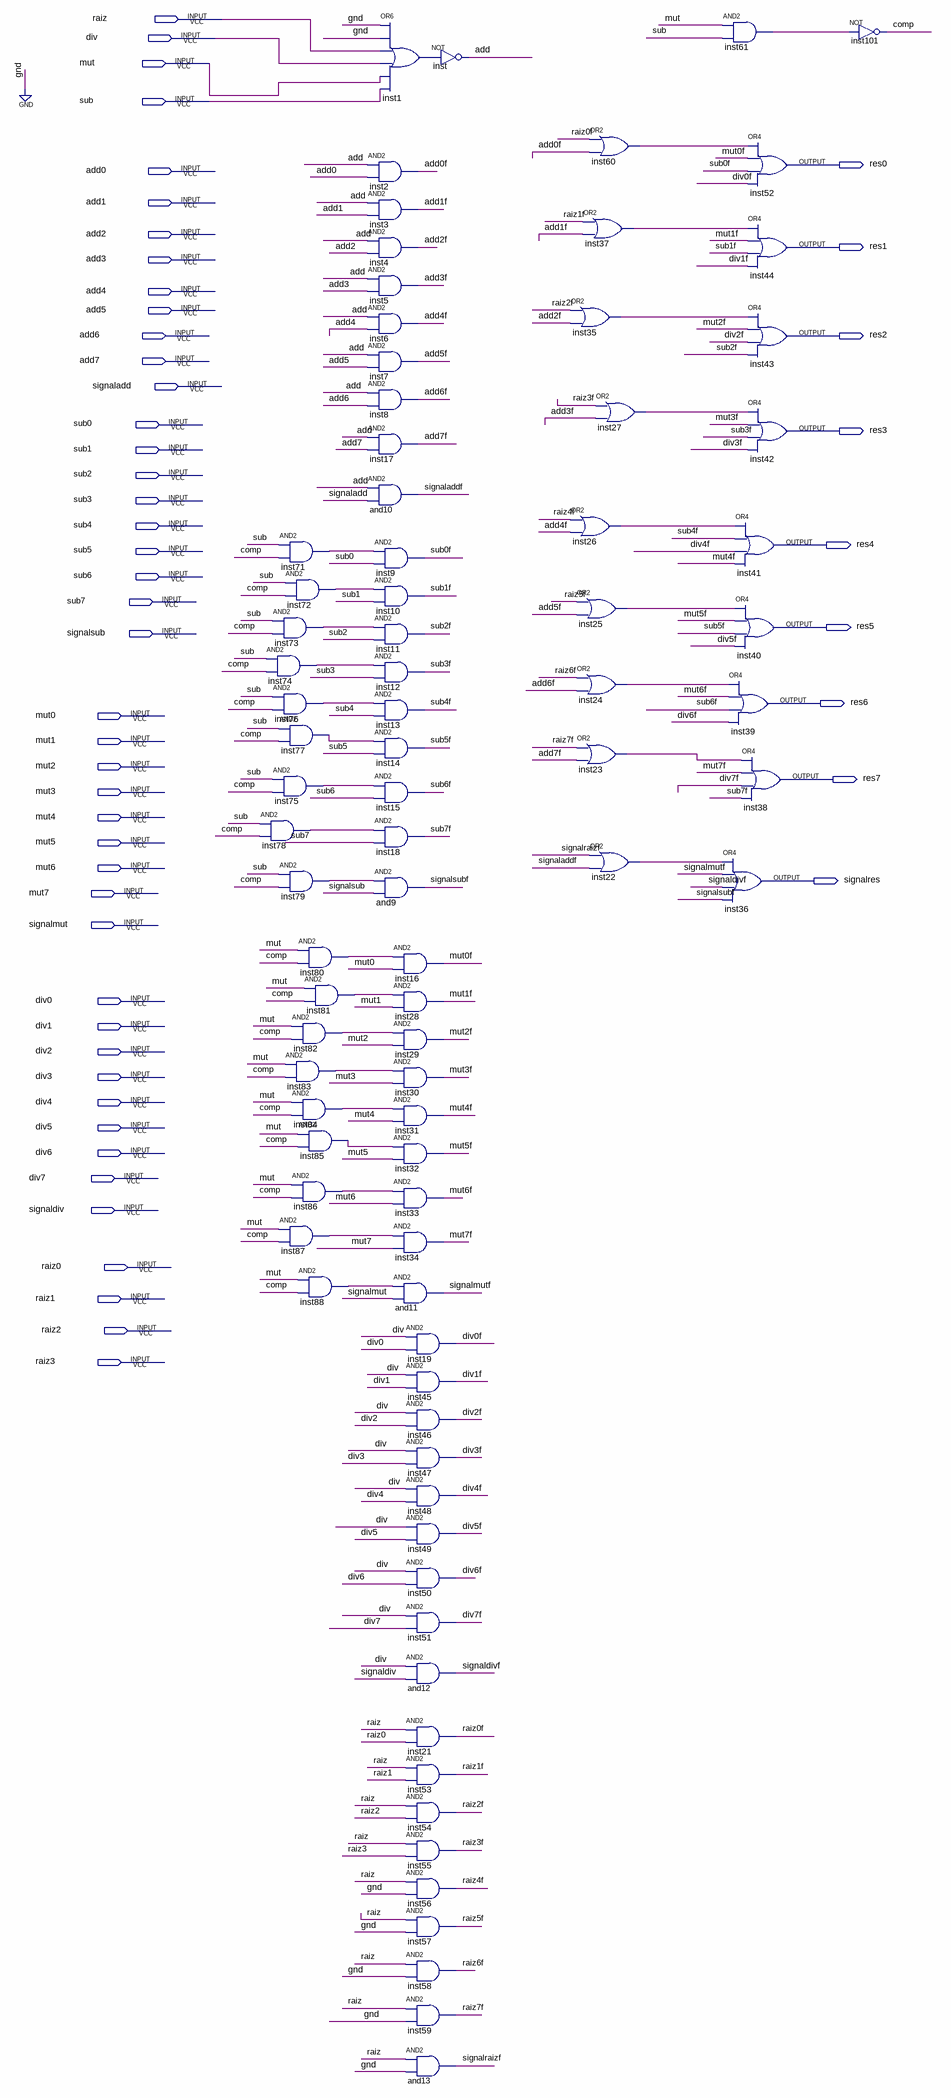
[diagram p0: schematic sheet]
// Quartus schematic mux.bdf as structural Verilog: 85 symbols, 53 pins
module mux (
  input  raiz,
  input  div,
  input  mut,
  input  sub,
  input  add0,
  input  add1,
  input  add2,
  input  add3,
  input  add4,
  input  add5,
  input  add6,
  input  add7,
  input  signaladd,
  input  sub0,
  input  sub1,
  input  sub2,
  input  sub3,
  input  sub4,
  input  sub5,
  input  sub6,
  input  sub7,
  input  signalsub,
  input  mut0,
  input  mut1,
  input  mut2,
  input  mut3,
  input  mut4,
  input  mut5,
  input  mut6,
  input  mut7,
  input  signalmut,
  input  div0,
  input  div1,
  input  div2,
  input  div3,
  input  div4,
  input  div5,
  input  div6,
  input  div7,
  input  signaldiv,
  input  raiz0,
  input  raiz1,
  input  raiz2,
  input  raiz3,
  output res0,
  output res1,
  output res2,
  output res3,
  output res4,
  output res5,
  output res6,
  output res7,
  output signalres
);

  wire add, add0f, add1f, add2f, add3f, add4f, add5f, add6f, add7f, comp, div0f, div1f, div2f, div3f, div4f,
       div5f, div6f, div7f, inst1_out, inst22_out, inst23_out, inst24_out, inst25_out, inst26_out,
       inst27_out, inst35_out, inst37_out, inst60_out, inst61_out, inst71_out, inst72_out, inst73_out,
       inst74_out, inst75_out, inst76_out, inst77_out, inst78_out, inst79_out, inst80_out, inst81_out,
       inst82_out, inst83_out, inst84_out, inst85_out, inst86_out, inst87_out, inst88_out, mut0f, mut1f,
       mut2f, mut3f, mut4f, mut5f, mut6f, mut7f, raiz0f, raiz1f, raiz2f, raiz3f, raiz4f, raiz5f, raiz6f,
       raiz7f, signaladdf, signaldivf, signalmutf, signalraizf, signalsubf, sub0f, sub1f, sub2f, sub3f,
       sub4f, sub5f, sub6f, sub7f;

  and inst71 (inst71_out, sub, comp);
  and inst72 (inst72_out, sub, comp);
  and inst73 (inst73_out, sub, comp);
  and inst74 (inst74_out, sub, comp);
  and inst76 (inst76_out, sub, comp);
  and inst77 (inst77_out, sub, comp);
  and inst75 (inst75_out, sub, comp);
  and inst78 (inst78_out, sub, comp);
  and inst79 (inst79_out, sub, comp);
  and inst80 (inst80_out, mut, comp);
  and inst82 (inst82_out, mut, comp);
  and inst83 (inst83_out, mut, comp);
  and inst84 (inst84_out, mut, comp);
  and inst85 (inst85_out, mut, comp);
  and inst86 (inst86_out, mut, comp);
  and inst87 (inst87_out, mut, comp);
  and inst88 (inst88_out, mut, comp);
  and inst81 (inst81_out, mut, comp);
  or inst1 (inst1_out, 1'b0, 1'b0, raiz, div, mut, sub);
  and inst2 (add0f, add, add0);
  and inst3 (add1f, add, add1);
  and inst4 (add2f, add, add2);
  and inst5 (add3f, add, add3);
  and inst6 (add4f, add, add4);
  and inst7 (add5f, add, add5);
  and inst8 (add6f, add, add6);
  and inst17 (add7f, add, add7);
  and and10 (signaladdf, add, signaladd);
  and inst9 (sub0f, inst71_out, sub0);
  and inst10 (sub1f, inst72_out, sub1);
  and inst11 (sub2f, inst73_out, sub2);
  and inst12 (sub3f, inst74_out, sub3);
  and inst13 (sub4f, inst76_out, sub4);
  and inst14 (sub5f, inst77_out, sub5);
  and inst15 (sub6f, inst75_out, sub6);
  and inst18 (sub7f, inst78_out, sub7);
  and and9 (signalsubf, inst79_out, signalsub);
  and inst16 (mut0f, inst80_out, mut0);
  and inst28 (mut1f, inst81_out, mut1);
  and inst29 (mut2f, inst82_out, mut2);
  and inst30 (mut3f, inst83_out, mut3);
  and inst31 (mut4f, inst84_out, mut4);
  and inst32 (mut5f, inst85_out, mut5);
  and inst33 (mut6f, inst86_out, mut6);
  and inst34 (mut7f, inst87_out, mut7);
  and and11 (signalmutf, inst88_out, signalmut);
  not inst (add, inst1_out);
  and inst19 (div0f, div, div0);
  and inst45 (div1f, div, div1);
  and inst46 (div2f, div, div2);
  and inst47 (div3f, div, div3);
  and inst48 (div4f, div, div4);
  and inst49 (div5f, div, div5);
  and inst50 (div6f, div, div6);
  and inst51 (div7f, div, div7);
  and and12 (signaldivf, div, signaldiv);
  and inst21 (raiz0f, raiz, raiz0);
  and inst53 (raiz1f, raiz, raiz1);
  and inst54 (raiz2f, raiz, raiz2);
  and inst55 (raiz3f, raiz, raiz3);
  and inst56 (raiz4f, raiz, 1'b0);
  and inst57 (raiz5f, raiz, 1'b0);
  and inst58 (raiz6f, raiz, 1'b0);
  and inst59 (raiz7f, raiz, 1'b0);
  and and13 (signalraizf, raiz, 1'b0);
  or inst60 (inst60_out, raiz0f, add0f);
  or inst37 (inst37_out, raiz1f, add1f);
  or inst35 (inst35_out, raiz2f, add2f);
  or inst27 (inst27_out, raiz3f, add3f);
  or inst26 (inst26_out, raiz4f, add4f);
  or inst25 (inst25_out, raiz5f, add5f);
  or inst24 (inst24_out, raiz6f, add6f);
  or inst23 (inst23_out, raiz7f, add7f);
  or inst22 (inst22_out, signalraizf, signaladdf);
  and inst61 (inst61_out, mut, sub);
  or inst52 (res0, inst60_out, mut0f, sub0f, div0f);
  or inst44 (res1, inst37_out, mut1f, sub1f, div1f);
  or inst43 (res2, inst35_out, mut2f, div2f, sub2f);
  or inst42 (res3, inst27_out, mut3f, sub3f, div3f);
  or inst41 (res4, inst26_out, sub4f, div4f, mut4f);
  or inst40 (res5, inst25_out, mut5f, sub5f, div5f);
  or inst39 (res6, inst24_out, mut6f, sub6f, div6f);
  or inst38 (res7, inst23_out, mut7f, div7f, sub7f);
  or inst36 (signalres, inst22_out, signalmutf, signaldivf, signalsubf);
  not inst101 (comp, inst61_out);
endmodule
